# Altium project BreakBoard_Project.PrjPcb
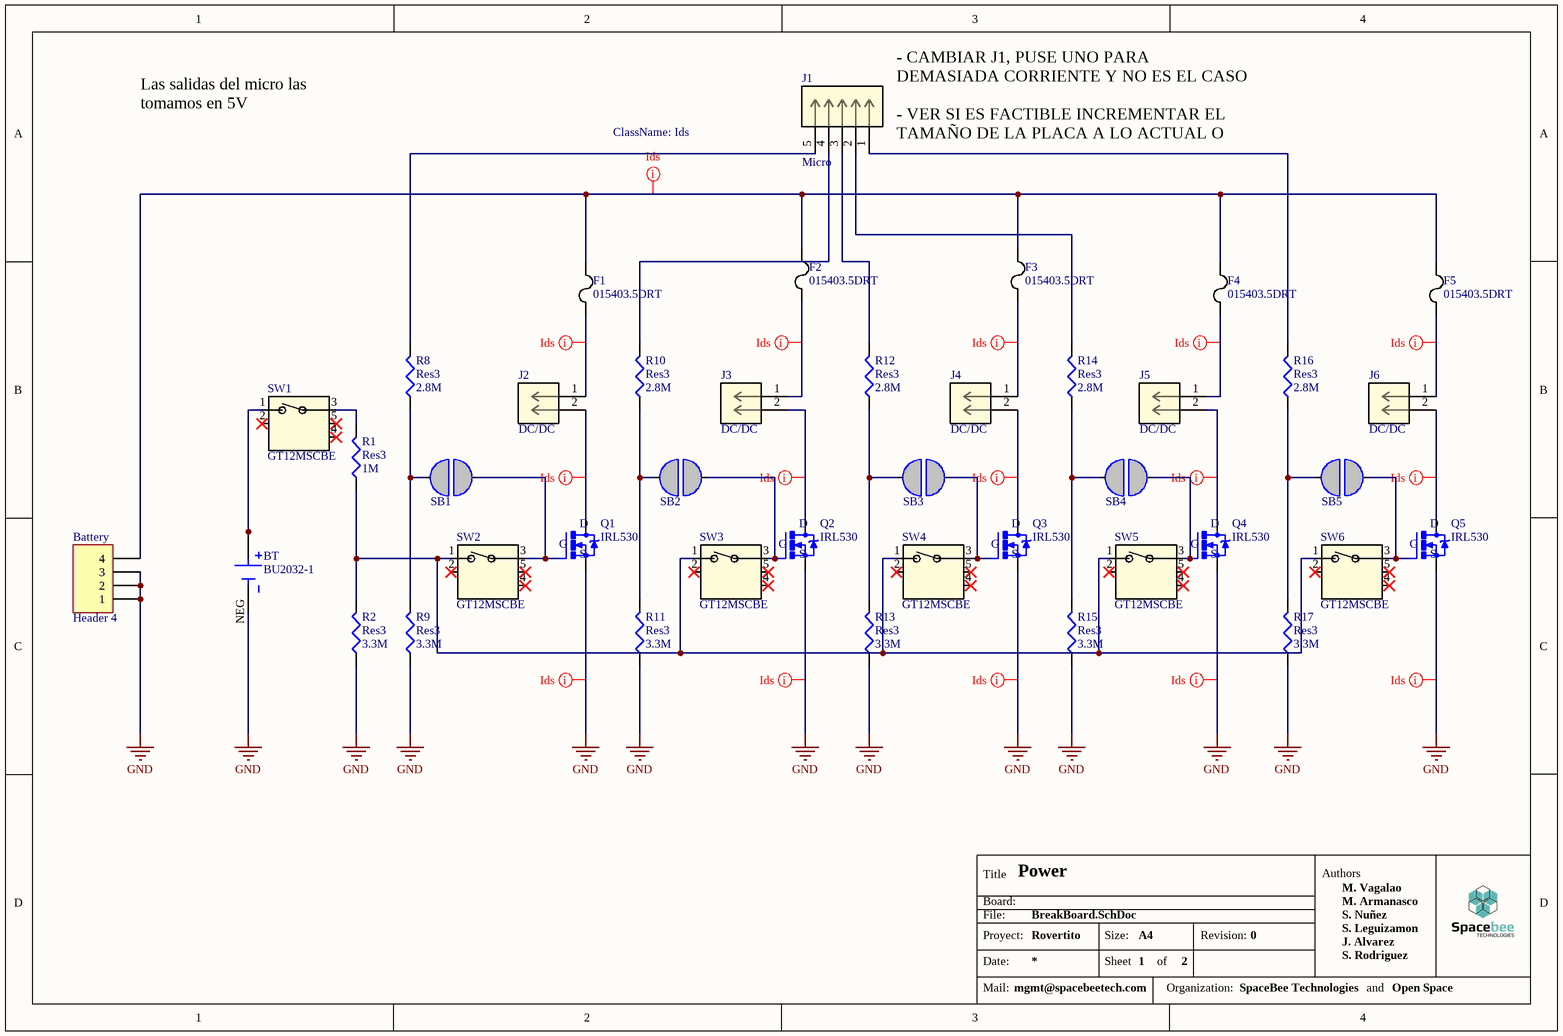
[diagram p0: BreakBoard.SchDoc]
1 sheet, 41 parts. Net scope: global (net labels, ports and power ports of the same name join across sheets).
Board file: BreakBoard_bigger.PcbDoc

## Sheet BreakBoard.SchDoc: Power
size A4; CompanyName: SpaceBee Technologies; Organization: Open Space; Address1: Argentina; DocumentNumber: 1; Revision: 0; SheetNumber: 1; SheetTotal: 2; Proyect: Rovertito; Mail: mgmt@spacebeetech.com

### Parts
Battery  Header 4  [292132-4_TYC]
BT  BU2032-1  [BAT_BU2032-1]
F1  015403.5DRT  [FUSE_Bourns]
F2  015403.5DRT  [FUSE_Bourns]
F3  015403.5DRT  [FUSE_Bourns]
F4  015403.5DRT  [FUSE_Bourns]
F5  015403.5DRT  [FUSE_Bourns]
J1  Micro  [MOLEX_532610571]
J2  DC/DC  [CON_1054302102_MOL]
J3  DC/DC  [CON_1054302102_MOL]
J4  DC/DC  [CON_1054302102_MOL]
J5  DC/DC  [CON_1054302102_MOL]
J6  DC/DC  [CON_1054302102_MOL]
Q1  IRL530  [IRL530NSTRLPBF_INF]
Q2  IRL530  [IRL530NSTRLPBF_INF]
Q3  IRL530  [IRL530NSTRLPBF_INF]
Q4  IRL530  [IRL530NSTRLPBF_INF]
Q5  IRL530  [IRL530NSTRLPBF_INF]
R1  Res3  value 1M  [J1-0603]
R2  Res3  value 3.3M  [J1-0603]
R8  Res3  value 2.8M  [RESC2012X60N]
R9  Res3  value 3.3M  [J1-0603]
R10  Res3  value 2.8M  [RESC2012X60N]
R11  Res3  value 3.3M  [J1-0603]
R12  Res3  value 2.8M  [RESC2012X60N]
R13  Res3  value 3.3M  [J1-0603]
R14  Res3  value 2.8M  [RESC2012X60N]
R15  Res3  value 3.3M  [J1-0603]
R16  Res3  value 2.8M  [RESC2012X60N]
R17  Res3  value 3.3M  [J1-0603]
SB1  SolderBridge  [PCBComponent_1]  (value not drawn)
SB2  SolderBridge  [PCBComponent_1]  (value not drawn)
SB3  SolderBridge  [PCBComponent_1]  (value not drawn)
SB4  SolderBridge  [PCBComponent_1]  (value not drawn)
SB5  SolderBridge  [PCBComponent_1]  (value not drawn)
SW1  GT12MSCBE  [SW5_GT12MSCBE_CNK]
SW2  GT12MSCBE  [SW5_GT12MSCBE_CNK]
SW3  GT12MSCBE  [SW5_GT12MSCBE_CNK]
SW4  GT12MSCBE  [SW5_GT12MSCBE_CNK]
SW5  GT12MSCBE  [SW5_GT12MSCBE_CNK]
SW6  GT12MSCBE  [SW5_GT12MSCBE_CNK]

### Nets
GND: Battery.1 Battery.2 Battery.3 BT.NEG Q1.3(S) Q2.3(S) Q3.3(S) Q4.3(S) Q5.3(S) R2.1 R9.1 R11.1 R13.1 R15.1 R17.1
NetBattery_4: Battery.4 F1.2 F2.2 F3.2 F4.2 F5.2
NetBT_S1+: BT.S1+(POS) BT.S2+(POS) SW1.1
NetF1_1: F1.1 J2.1
NetF2_1: F2.1 J3.1
NetF3_1: F3.1 J4.1
NetF4_1: F4.1 J5.1
NetF5_1: F5.1 J6.1
NetJ1_1: J1.1 R16.2
NetJ1_2: J1.2 R14.2
NetJ1_3: J1.3 R12.2
NetJ1_4: J1.4 R10.2
NetJ1_5: J1.5 R8.2
NetJ2_2: J2.2 Q1.2(D)
NetJ3_2: J3.2 Q2.2(D)
NetJ4_2: J4.2 Q3.2(D)
NetJ5_2: J5.2 Q4.2(D)
NetJ6_2: J6.2 Q5.2(D)
NetQ1_1: Q1.1(G) SB1.0 SW2.3
NetQ2_1: Q2.1(G) SB2.0 SW3.3
NetQ3_1: Q3.1(G) SB3.0 SW4.3
NetQ4_1: Q4.1(G) SB4.0 SW5.3
NetQ5_1: Q5.1(G) SB5.0 SW6.3
NetR1_1: R1.1 R2.2 SW2.1 SW3.1 SW4.1 SW5.1 SW6.1
NetR1_2: R1.2 SW1.3
NetR8_1: R8.1 R9.2 SB1.1
NetR10_1: R10.1 R11.2 SB2.1
NetR12_1: R12.1 R13.2 SB3.1
NetR14_1: R14.1 R15.2 SB4.1
NetR16_1: R16.1 R17.2 SB5.1

Not connected (* = marked no-connect by the designer): SW1 2* 4* 5(6)*; SW2 2* 4* 5(6)*; SW3 2* 4* 5(6)*; SW4 2* 4* 5(6)*; SW5 2* 4* 5(6)*; SW6 2* 4* 5(6)*

### Layout directives
net class Ids; rule Width Constraint [Pref Width = 22mil    Min Width = 22mil    Max Width = 22mil]: NetBattery_4
net class Undefined; rule Width Constraint [Pref Width = 22mil    Min Width = 22mil    Max Width = 22mil]; rule Clearance Constraint [Clearance = 0.6mil]: GND, NetF1_1, NetF2_1, NetF3_1, NetF4_1, NetF5_1, NetJ2_2, NetJ3_2, NetJ4_2, NetJ5_2, NetJ6_2

### Notes on the sheet
- Las salidas del micro las tomamos en 5V
- (near J1) - CAMBIAR J1, PUSE UNO PARA DEMASIADA CORRIENTE Y NO ES EL CASO
  - VER SI ES FACTIBLE INCREMENTAR EL TAMAÑO DE LA PLACA A LO ACTUAL O NO
- Title
- Board:
- File:
- Authors
- M. Armanasco
- S. Nuñez
- M. Vagalao
- Proyect:
- Date:
- Mail:
- Size:
- Sheet
- A4
- of
- Organization:
- Revision:
- S. Rodriguez
- S. Leguizamon
- J. Alvarez
- and

### Library data of the parts
Battery = Header 4: Header, 4-Pin; LatestRevisionDate: 17-Jul-2002; LatestRevisionNote: Re-released for DXP Platform.; Publisher: Altium Limited
BT = BU2032-1: HOLDER CR2032 W/ PC PINS; MF: MPD; Package: Non-Standard MPD; Value: *; MP: BU2032-1; DigiKey-Purchase-URL: https://snapeda.com/shop?store=DigiKey&id=4219651; SnapEDA_Link: https://www.snapeda.com/parts/BU2032-1/Memory%20Protection%20Devices/view-part/4219651/?ref=snap
F1-F5 = 015403.5DRT: No Description Available; Mfr_Name: Littelfuse Inc; Type: DEV; Copyright: Copyright (C) 2022 Ultra Librarian. All rights reserved.; Manufacturer_Part_Number: 015403.5DRT; RefDes: RefDes
J1 = HTSW-105-07-L-S: No Description Available; Mfr_Name: Samtec Inc; Copyright: Copyright (C) 2022 Ultra Librarian. All rights reserved.; Manufacturer_Part_Number: HTSW-105-07-L-S; Digi-Key_Part_Number_1: SAM11370-ND; RefDes: RefDes; Type: DEV
J2-J6 = TSW-102-05-T-S: No Description Available; Mfr_Name: Samtec Inc; Copyright: Copyright (C) 2022 Ultra Librarian. All rights reserved.; Manufacturer_Part_Number: TSW-102-05-T-S; Digi-Key_Part_Number_1: SAM1019-02-ND; Digi-Key_Part_Number_2: TSW-102-05-T-S-NDL; Digi-Key_Part_Number_3: 612-TSW-102-05-T-S-ND; RefDes: RefDes; Type: DEV
Q1-Q5 = IRL530: N-Channel 100V 15A (Tc) 88W (Tc) Through Hole TO-220AB; MF: Vishay / Siliconix; Price: None; Value: *; Package: TO-220-3 Vishay / Siliconix; SnapEDA_Link: https://www.snapeda.com/parts/IRL530/Vishay%20Siliconix/view-part/4705327/?ref=snap; Availability: Unavailable; MP: IRL530
R1 R2 R8-R17 = Res3: Resistor; Published: 8-Jun-2000; LatestRevisionDate: 29-May-2009; LatestRevisionNote: IPC-7351 Footprint Added.; PackageReference: J1-0603; Publisher: Altium Limited; PackageDescription: Chip Resistor
SB1-SB5 = Component_1
SW1-SW6 = GT12MSCBE: No Description Available; Mfr_Name: C&K; Copyright: Copyright (C) 2022 Ultra Librarian. All rights reserved.; Manufacturer_Part_Number: GT12MSCBE; Digi-Key_Part_Number_1: CKN9050TR-ND; Digi-Key_Part_Number_2: CKN9050CT-ND; Digi-Key_Part_Number_3: CKN9050DKR-ND; Digi-Key_Part_Number_4: CKN9050TR-NDL; RefDes: RefDes; Type: DEV